# EAGLE design controller15 (EAGLE 9.4.2)

## Sheet 1 of 2
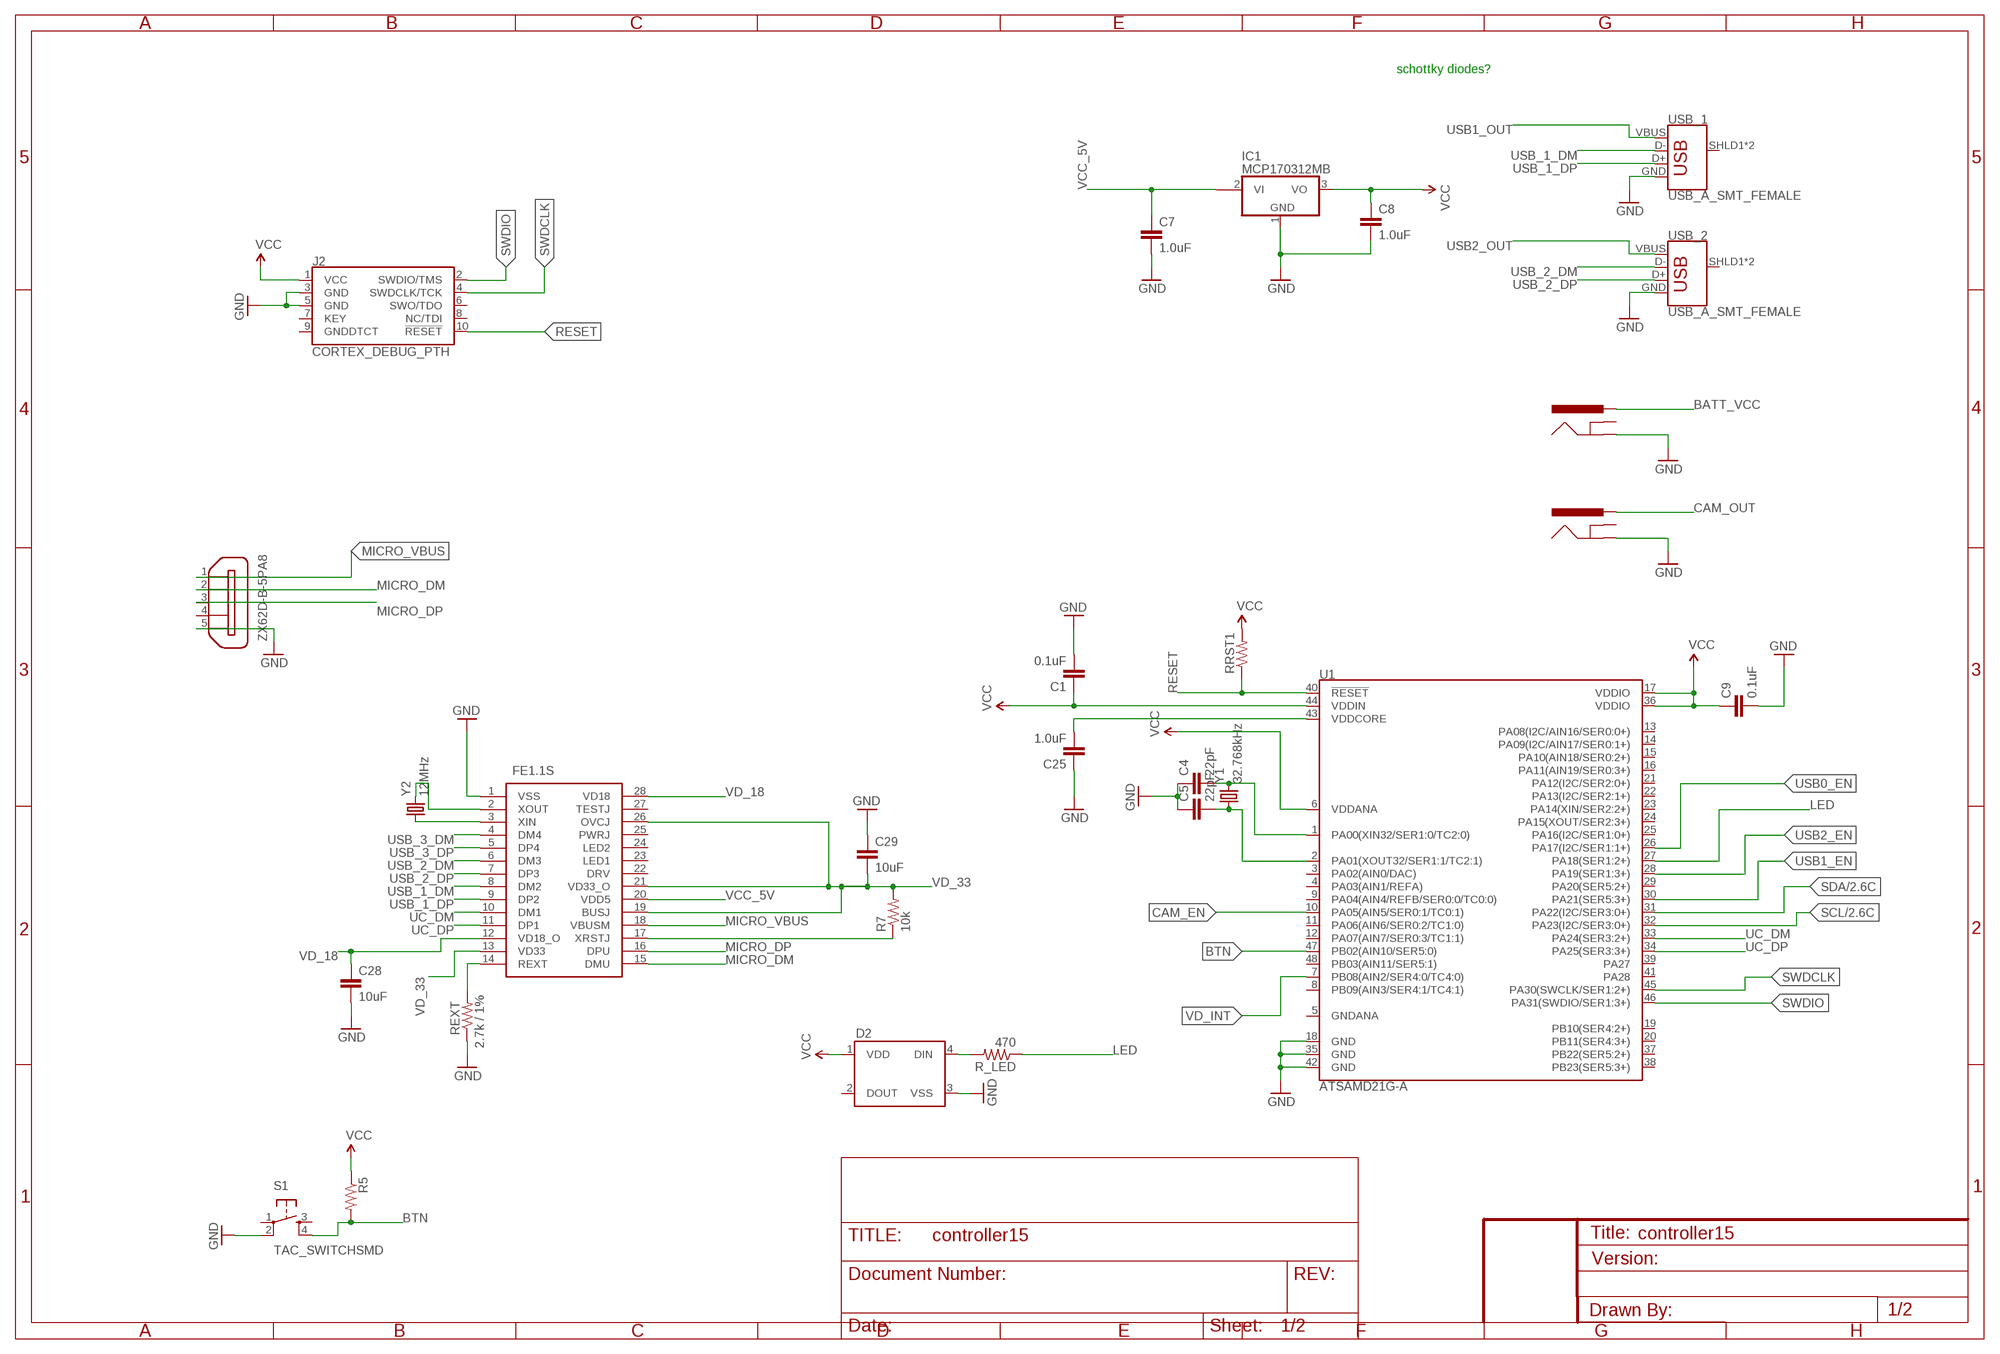
[diagram p0: schematic, sheet 1]

### Parts
C1  0.1uF  1.0UF-0805-25V-10%  [0805]
C4  22pF  CAP0805  [0805]
C5  22pF  CAP0805  [0805]
C7  1.0uF  1.0UF-1206-50V-10%  [1206]
C8  1.0uF  1.0UF-1206-50V-10%  [1206]
C9  0.1uF  1.0UF-0805-25V-10%  [0805]
C25  1.0uF  1.0UF-0805-25V-10%  [0805]
C28  10uF  1.0UF-0805-25V-10%  [0805]
C29  10uF  1.0UF-0805-25V-10%  [0805]
D2  WS2812B  [WS2812B]
IC1  MCP170312MB  [SOT89]
IC3  FE1.1S  [SOP64P600X175-28N]
J2  CORTEX_DEBUG_PTH  [2X5-PTH-1.27MM]
J3  POWER_JACKPTH_BREAD  [POWER_JACK_PTH_BREAD]
J4  POWER_JACKPTH_BREAD  [POWER_JACK_PTH_BREAD]
R5  RESISTOR0805-RES  [0805]
R7  10k  RESISTOR0805-RES  [0805]
R_LED  470  RESISTOR0805-RES  [0805]
REXT  2.7k / 1%  RESISTOR0805-RES  [0805]
RRST1  RESISTOR0805-RES  [0805]
S1  TAC_SWITCHSMD  [TACTILE-SWITCH-SMD]
U1  ATSAMD21G-A  [TQFP-48]
USB_1  USB_A_SMT_FEMALE  [USB-A-S-SILK-FEMALE]
USB_2  USB_A_SMT_FEMALE  [USB-A-S-SILK-FEMALE]
X2  ZX62D-B-5PA8  [ZX62D-B-5PA8]
Y1  32.768kHz  CRYSTAL3.2X1.5MM  [CRYSTAL-SMD-3.2X1.5MM]
Y2  12MHz  CRYSTAL3.2X1.5MM  [CRYSTAL-SMD-3.2X1.5MM]

### Nets
BATT_VCC [hub_power]: J4.PWR ; also sheet 2
BTN: R5.2 S1.4 U1.47(PB02(AIN10/SER5:0))
CAM_EN: U1.10(PA05(AIN5/SER0:1/TC0:1)) ; also sheet 2
CAM_OUT: J3.PWR ; also sheet 2
GND: C1.2 C4.1 C5.1 C7.2 C8.2 C9.2 C25.1 C28.2 C29.1 D2.3(VSS) IC1.1(GND) IC3.1(VSS) J2.3(GND) J2.5(GND) J3.GND J4.GND REXT.1 S1.2 U1.18(GND) U1.35(GND) U1.42(GND) USB_1.GND USB_2.GND X2.5 ; also sheet 2
LED: R_LED.1 U1.27(PA18(SER1:2+))
MICRO_DM: IC3.15(DMU) X2.2
MICRO_DP: IC3.16(DPU) X2.3
MICRO_VBUS: IC3.18(VBUSM) X2.1 ; also sheet 2
N$5: C25.2 U1.43(VDDCORE)
N$7: D2.4(DIN) R_LED.2
N$8: C4.2 U1.1(PA00(XIN32/SER1:0/TC2:0)) Y1.P$2
N$15: IC3.17(XRSTJ) R7.1
N$23: IC3.3(XIN) Y2.P$1
N$24: IC3.2(XOUT) Y2.P$2
N$31: IC3.14(REXT) REXT.2
N$32: C5.2 U1.2(PA01(XOUT32/SER1:1/TC2:1)) Y1.P$1
RESET: J2.10(!RESET) RRST1.1 U1.40(!RESET!)
SCL: U1.32(PA23(I2C/SER3:0+)) ; also sheet 2
SDA: U1.31(PA22(I2C/SER3:0+)) ; also sheet 2
SWDCLK: J2.4(SWDCLK/TCK) U1.45(PA30(SWCLK/SER1:2+))
SWDIO: J2.2(SWDIO/TMS) U1.46(PA31(SWDIO/SER1:3+))
UC_DM: IC3.10(DM1) U1.33(PA24(SER3:2+))
UC_DP: IC3.11(DP1) U1.34(PA25(SER3:3+))
USB0_EN: U1.26(PA17(I2C/SER1:1+)) ; also sheet 2
USB1_EN: U1.30(PA21(SER5:3+)) ; also sheet 2
USB1_OUT: USB_1.VBUS ; also sheet 2
USB2_EN: U1.28(PA19(SER1:3+)) ; also sheet 2
USB2_OUT: USB_2.VBUS ; also sheet 2
USB_1_DM: IC3.8(DM2) USB_1.D-
USB_1_DP: IC3.9(DP2) USB_1.D+
USB_2_DM: IC3.6(DM3) USB_2.D-
USB_2_DP: IC3.7(DP3) USB_2.D+
USB_3_DM: IC3.4(DM4)
USB_3_DP: IC3.5(DP4)
VCC [power]: C1.1 C8.1 C9.1 D2.1(VDD) IC1.3(VO) J2.1(VCC) R5.1 RRST1.2 U1.6(VDDANA) U1.17(VDDIO) U1.36(VDDIO) U1.44(VDDIN) ; also sheet 2
VCC_5V [power]: C7.1 IC1.2@1(VI1) IC3.20(VDD5) ; also sheet 2
VD_18: C28.1 IC3.12(VD18_O) IC3.28(VD18)
VD_33: C29.2 IC3.13(VD33) IC3.19(BUSJ) IC3.21(VD33_O) IC3.26(OVCJ) R7.2
VD_INT: U1.7(PB08(AIN2/SER4:0/TC4:0)) ; also sheet 2
Unconnected: D2.2(DOUT) IC1.2(VI) IC3.22(DRV) IC3.23(LED1) IC3.24(LED2) IC3.25(PWRJ) IC3.27(TESTJ) J2.6(SWO/TDO) J2.7(KEY) J2.8(NC/TDI) J2.9(GNDDTCT) J3.GNDBREAK J4.GNDBREAK S1.1 S1.3 U1.3(PA02(AIN0/DAC)) U1.4(PA03(AIN1/REFA)) U1.5(GNDANA) U1.8(PB09(AIN3/SER4:1/TC4:1)) U1.9(PA04(AIN4/REFB/SER0:0/TC0:0)) U1.11(PA06(AIN6/SER0:2/TC1:0)) U1.12(PA07(AIN7/SER0:3/TC1:1)) U1.13(PA08(I2C/AIN16/SER0:0+)) U1.14(PA09(I2C/AIN17/SER0:1+)) U1.15(PA10(AIN18/SER0:2+)) U1.16(PA11(AIN19/SER0:3+)) U1.19(PB10(SER4:2+)) U1.20(PB11(SER4:3+)) U1.21(PA12(I2C/SER2:0+)) U1.22(PA13(I2C/SER2:1+)) U1.23(PA14(XIN/SER2:2+)) U1.24(PA15(XOUT/SER2:3+)) U1.25(PA16(I2C/SER1:0+)) U1.29(PA20(SER5:2+)) U1.37(PB22(SER5:2+)) U1.38(PB23(SER5:3+)) U1.39(PA27) U1.41(PA28) U1.48(PB03(AIN11/SER5:1)) USB_1.SHLD1(SHIELD) USB_1.SHLD2(SHIELD) USB_2.SHLD1(SHIELD) USB_2.SHLD2(SHIELD) X2.4 X2.S1 X2.S2 X2.S3 X2.S4

### Notes on the sheet
- schottky diodes?

## Sheet 2 of 2
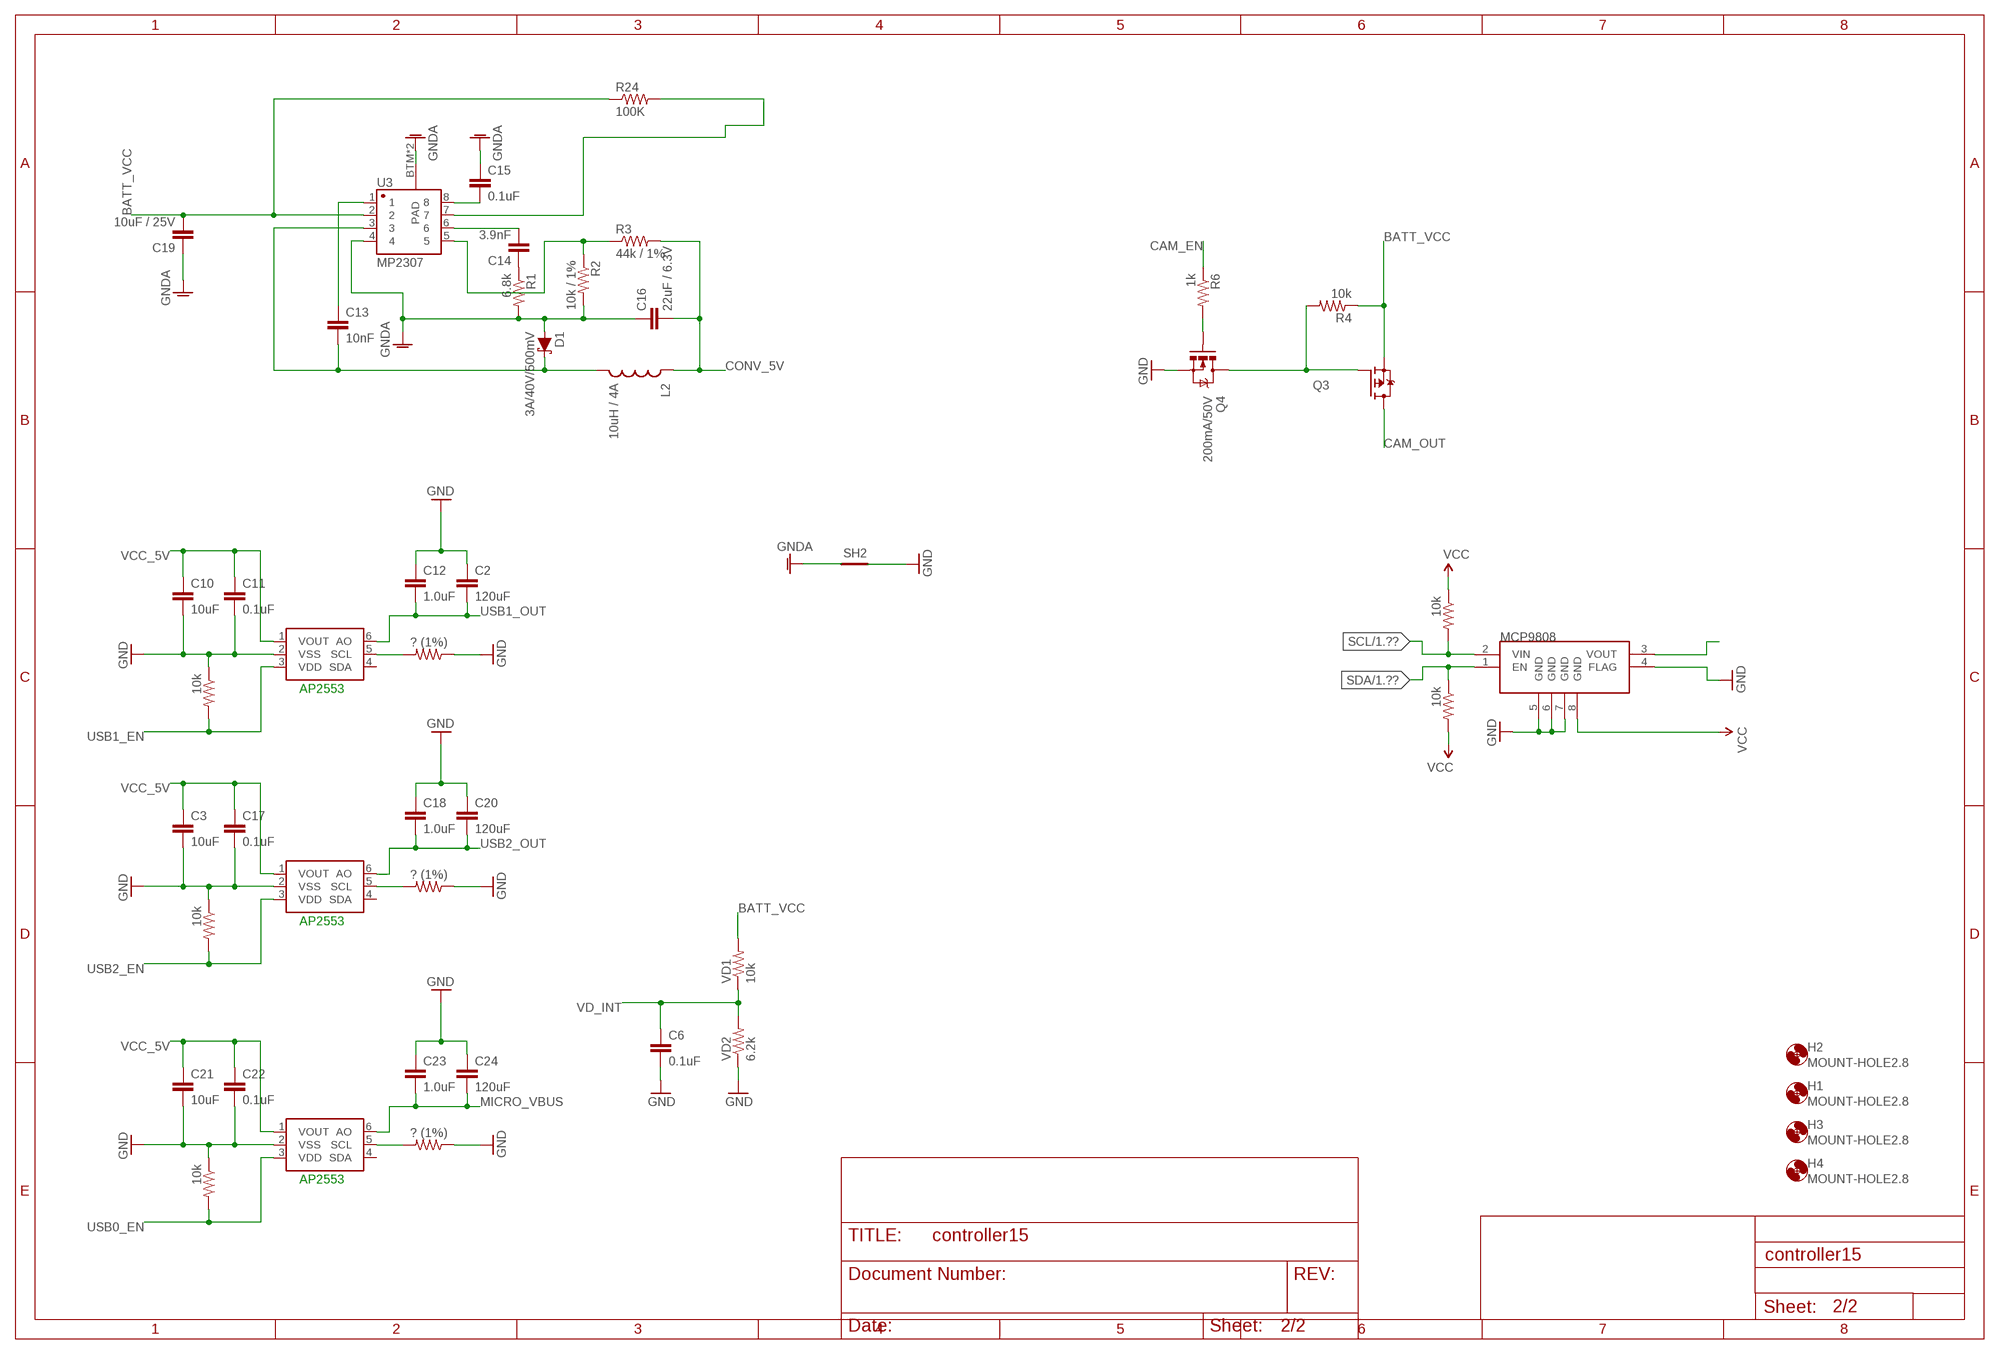
[diagram p1: schematic, sheet 2]

### Parts
AP1  MCP4725  MCP4725SOT-23  [SOT23-6]
AP2  MCP4725  MCP4725SOT-23  [SOT23-6]
AP2553  MCP4725  MCP4725SOT-23  [SOT23-6]
C2  120uF  1.0UF-1206-50V-10%  [1206]
C3  10uF  1.0UF-1206-50V-10%  [1206]
C6  0.1uF  CAP1206  [1206]
C10  10uF  1.0UF-1206-50V-10%  [1206]
C11  0.1uF  1.0UF-0805-25V-10%  [0805]
C12  1.0uF  1.0UF-1206-50V-10%  [1206]
C13  10nF  CAP0805  [0805]
C14  3.9nF  CAP1206  [1206]
C15  0.1uF  CAP1206  [1206]
C16  22uF / 6.3V  CAP1210  [1210]
C17  0.1uF  1.0UF-0805-25V-10%  [0805]
C18  1.0uF  1.0UF-1206-50V-10%  [1206]
C19  10uF / 25V  CAP1210  [1210]
C20  120uF  1.0UF-1206-50V-10%  [1206]
C21  10uF  1.0UF-1206-50V-10%  [1206]
C22  0.1uF  1.0UF-0805-25V-10%  [0805]
C23  1.0uF  1.0UF-1206-50V-10%  [1206]
C24  120uF  1.0UF-1206-50V-10%  [1206]
D1  3A/40V/500mV  DIODE-SCHOTTKY-B340A  [SMA-DIODE]
H1  MOUNT-HOLE2.8  [2,8]
H2  MOUNT-HOLE2.8  [2,8]
H3  MOUNT-HOLE2.8  [2,8]
H4  MOUNT-HOLE2.8  [2,8]
L2  10uH / 4A  INDUCTORSRU1038  [SRU1038]
MCP9808  V_REG_MIC5216  [MSOP8]
Q3  FDD4141TO252  [TO252]
Q4  200mA/50V  MOSFET-NCHANNELBSS138  [SOT23-3]
R1  6.8k  RESISTOR1206  [1206]
R2  10k / 1%  RESISTOR1206  [1206]
R3  44k / 1%  RESISTOR1206  [1206]
R4  10k  RESISTOR0805-RES  [0805]
R6  1k  RESISTOR0805-RES  [0805]
R24  100K  RESISTOR1206  [1206]
R_I2C_1  10k  RESISTOR0805-RES  [0805]
R_I2C_2  10k  RESISTOR0805-RES  [0805]
R_MOSFET_USB1  ? (1%)  RESISTOR0805-RES  [0805]
R_MOSFET_USB2  ? (1%)  RESISTOR0805-RES  [0805]
R_MOSFET_USB3  10k  RESISTOR0805-RES  [0805]
R_MOSFET_USB4  10k  RESISTOR0805-RES  [0805]
R_MOSFET_USB5  ? (1%)  RESISTOR0805-RES  [0805]
R_MOSFET_USB6  10k  RESISTOR0805-RES  [0805]
SH2  SHORT-HT5  [SHORT_TOP-50]
U3  MP2307  GENERIC-SOIC8MSGEQ7N-FILTER  [SO08]
VD1  10k  RESISTOR1206  [1206]
VD2  6.2k  RESISTOR1206  [1206]

### Nets
BATT_VCC [hub_power]: C19.2 Q3.2(S) R4.1 R24.1 U3.2 VD1.2 ; also sheet 1
CAM_EN: R6.1 ; also sheet 1
CAM_OUT: Q3.3(D) ; also sheet 1
CONV_5V [power]: C16.2 L2.1 R3.2
GND: AP1.2(VSS) AP2.2(VSS) AP2553.2(VSS) C2.1 C3.2 C6.2 C10.2 C11.2 C12.1 C17.2 C18.1 C20.1 C21.2 C22.2 C23.1 C24.1 MCP9808.4(FLAG) MCP9808.5(GND) MCP9808.6(GND) MCP9808.7(GND) Q4.2(S) R_MOSFET_USB1.1 R_MOSFET_USB2.1 R_MOSFET_USB3.1 R_MOSFET_USB4.1 R_MOSFET_USB5.1 R_MOSFET_USB6.1 SH2.2 VD2.1 ; also sheet 1
GNDA [power]: C15.1 C16.1 C19.1 D1.A R1.2 R2.2 SH2.1 U3.4 U3.BTM(PAD) U3.P$1(PAD)
MICRO_VBUS: AP2.6(AO) C23.2 C24.2 ; also sheet 1
N$2: Q4.1(G) R6.2
N$3: Q3.1(G) Q4.3(D) R4.2
N$4: MCP9808.3(VOUT)
N$9: AP2553.5(SCL) R_MOSFET_USB1.2
N$10: AP1.5(SCL) R_MOSFET_USB2.2
N$11: AP2.5(SCL) R_MOSFET_USB5.2
N$25: C15.2 U3.8
N$26 [power]: C13.2 D1.C L2.2 U3.3
N$27: C13.1 U3.1
N$28: C14.1 R1.1
N$29: C14.2 U3.6
N$30: R2.1 R3.1 U3.5
PB_BUCK_EN: R24.2 U3.7
SCL: MCP9808.2(VIN) R_I2C_1.2 ; also sheet 1
SDA: MCP9808.1(EN) R_I2C_2.1 ; also sheet 1
USB0_EN: AP2.3(VDD) R_MOSFET_USB6.2 ; also sheet 1
USB1_EN: AP2553.3(VDD) R_MOSFET_USB3.2 ; also sheet 1
USB1_OUT: AP2553.6(AO) C2.2 C12.2 ; also sheet 1
USB2_EN: AP1.3(VDD) R_MOSFET_USB4.2 ; also sheet 1
USB2_OUT: AP1.6(AO) C18.2 C20.2 ; also sheet 1
VCC [power]: MCP9808.8(GND) R_I2C_1.1 R_I2C_2.2 ; also sheet 1
VCC_5V [power]: AP1.1(VOUT) AP2.1(VOUT) AP2553.1(VOUT) C3.1 C10.1 C11.1 C17.1 C21.1 C22.1 ; also sheet 1
VD_INT: C6.1 VD1.1 VD2.2 ; also sheet 1
Unconnected: AP1.4(SDA) AP2.4(SDA) AP2553.4(SDA)

### Notes on the sheet
- AP2553
- AP2553
- AP2553

## Library data of the parts
AP1 AP2 AP2553 = SparkFun-IC-Conversion:MCP4725: MCP4725 DAC Microchip 12-bit I2C DAC, SOT23-6 Datasheet <https://cdn.sparkfun.com/datasheets/BreakoutBoards/MCP4725_2009.pdf> SparkFun Products SparkFun I2C DAC Breakout - MCP4725 <https://www.sparkfun.com/products/12918> (BOB-12918); PROD_ID: IC-08886
C1 C9 C11 C17 C22 C28 C29 = SparkFun-Capacitors:1.0UF: 1µF ceramic capacitors A capacitor is a passive two-terminal electrical component used to store electrical energy temporarily in an electric field.; PROD_ID: CAP-08064; VALUE: 1.0uF
C2 C3 C10 C20 C21 C24 = SparkFun-Capacitors:1.0UF: 1µF ceramic capacitors A capacitor is a passive two-terminal electrical component used to store electrical energy temporarily in an electric field.; PROD_ID: CAP-09822; VALUE: 1.0uF
C4 C5 = SparkFun-Passives:CAP: Capacitor Standard 0603 ceramic capacitor, and 0.1" leaded capacitor.
C6 C13-C16 C19 = SparkFun-Capacitors:CAP: Capacitor Standard 0603 ceramic capacitor, and 0.1" leaded capacitor.
C7 C8 C12 C18 C23 = SparkFun-Capacitors:1.0UF: 1µF ceramic capacitors A capacitor is a passive two-terminal electrical component used to store electrical energy temporarily in an electric field.; PROD_ID: CAP-09822
C25 = SparkFun-Capacitors:1.0UF: 1µF ceramic capacitors A capacitor is a passive two-terminal electrical component used to store electrical energy temporarily in an electric field.; PROD_ID: CAP-08064
D1 = SparkFun-DiscreteSemi:DIODE-SCHOTTKY: Schottky diode A Schottky diode is a semiconductor diode which has a low forward voltage drop and a very fast switching action.; PROD_ID: DIO-09886
D2 = SparkFun-LED:WS2812B: WS2812B - Intelligent control LED integrated light source Technical Specifications: Power Supply Voltage (VDD): 3.5 to 5.3 V Input Voltage (VI): -0.5 to VDD+0.5 V Operating Junction Temperature (Topt): -25°C to +80°C Storage Temperature Range (Tstg): -55°C to +150°C; PROD_ID: DIO-12503
H1-H4 = holes:MOUNT-HOLE: MOUNTING HOLE with drill center marker
IC1 = linear:MCP1703*: 250 mA, 16V, Low Quiescent Current LDO Regulator Source: http://ww1.microchip.com/downloads/en/DeviceDoc/22049b.pdf
IC3 = FE1.1S:FE1.1S: USB 2.0 HIGH SPEED 4-PORT HUB CONTROLLER Source: Datasheet <https://cdn-shop.adafruit.com/product-files/2991/FE1.1s Data Sheet (Rev. 1.0).pdf>; DESCRIPTION: USB 2.0 HIGH SPEED 4-PORT HUB CONTROLLER; HEIGHT: 1.75mm; MANUFACTURER_NAME: JFD IC; MANUFACTURER_PART_NUMBER: FE1.1S
J2 = SparkFun-Connectors:CORTEX_DEBUG: Cortex Debug Connector - 10 pin Supports JTAG debug, Serial Wire debug, and Serial Wire Viewer. PTH and SMD connector options available. General Connector Information <http://infocenter.arm.com/help/topic/com.arm.doc.faqs/attached/13634/cortex_debug_connectors.pdf> Products: PTH Connector <http://www.digikey.com/product-detail/en/cnc-tech/3220-10-0100-00/1175-1627-ND/3883661> -via Digi-Key SparkFun PSoc <https://www.sparkfun.com/products/13229> SparkFun T <https://www.sparkfun.com/products/13810>
J3 J4 = SparkFun-Connectors:POWER_JACK: Power Jack Connector This is the standard 5.5mm barrel jack for power. The PTH is the most common, proven, reliable, footprint. The Slot footprint only works if the mill layer is transmitted to the PCB fab house so be warned. Here are the connectors we sell at SparkFun: DC Barrel Power Jack/Connector <https://www.sparkfun.com/products/119> (PRT-00119) DC Barrel Power Jack/Connector (SMD) <https://www.sparkfun.com/products/12748> (PRT-12748) DC Barrel Jack Adapter - Breadboard Compatible <https://www.sparkfun.com/products/10811> (PRT-10811) It is used on this SparkFun product (and many, many others): SparkFun RedBoard - Programmed with Arduino <https://www.sparkfun.com/products/12757> (DEV-12757) Also, if you need a mating power supply or connector, please check these out: Wall Adapter Power Supply - 9VDC 650mA <https://www.sparkfun.com/products/298> (TOL-00298) DC Barrel Jack Adapter - Male <https://www.sparkfun.com/products/10287> (PRT-10287); PROD_ID: PRT-10811
L2 = SparkFun-Passives:INDUCTOR: Inductors Basic Inductor/Choke - 0603 and 1206. Footprints are not proven and vary greatly between part numbers. INDUCTOR POWER 3.3UH 4.0A SMD 0.197" L x 0.197" W x 0.177" H (5.00mm x 5.00mm x 4.50mm)
MCP9808 = SparkFun-IC-Power:V_REG_MIC5216: 500mA LDO, MSOP8 for better dissipation; PROD_ID: IC-09527
Q3 = transistor-fet:FDD4141: P-Channel PowerTrench® MOSFET Source: FDD4141.pdf
Q4 = SparkFun-DiscreteSemi:MOSFET-NCHANNEL: Common NMOSFET Parts MFG P/N Store ID Prod ID FDD8780 TRANS-09984 SI7820DN TRANS-11055 FDS6630A IC-08089 2N7002PW TRANS-11151 FQP30N06L COM-10213 TRANS-10060 BSS123LT1G TRANS-08345 BSS138 TRANS-00830 BS170 2N7000; PROD_ID: TRANS-00830
R1-R4 R6 R24 R_LED = SparkFun-Resistors:RESISTOR: Resistor Basic schematic elements and footprints for 0603, 1206, and PTH resistors.
R5 R7 R_I2C_1 R_I2C_2 R_MOSFET_USB1-R_MOSFET_USB6 REXT RRST1 VD1 VD2 = SparkFun-Passives:RESISTOR: Resistor Basic schematic elements and footprints for 0603, 1206, and PTH resistors.
S1 = SparkFun-Retired:TAC_SWITCH: Momentary Switch Button commonly used for reset or general input. Spark Fun Electronics SKU : COM-00097 SMT- SWCH-08247; PROD_ID: SWCH-08247
SH2 = shorts:SHORT-H: Short between two nets; BOM: no
U1 = SparkFun-IC-Microcontroller:ATSAMD21G: Atmel SAMD21G SMART ARM-Based Microcontroller The Atmel ® | SMART ™ SAM D21 is a series of low-power microcontrollers using the 32-bit ARM ® Cortex ® -M0+ processor, and ranging from 32- to 64-pins with up to 256KB Flash and 32KB of SRAM. The SAM D21 devices operate at a maximum frequency of 48MHz and reach 2.46 CoreMark/MHz. They are designed for simple and intuitive migration with identical peripheral modules, hex compatible code, identical linear address map and pin compatible migration paths between all devices in the product series. All devices include intelligent and flexible peripherals, Atmel Event System for inter-peripheral signaling, and support for capacitive touch button, slider and wheel user interfaces. Datasheet <https://cdn.sparkfun.com/datasheets/Dev/Arduino/Boards/Atmel-42181-SAM-D21_Datasheet.pdf> SparkFun Products SparkFun SAMD21 Mini Breakout <https://www.sparkfun.com/products/13664> (DEV-13664) SparkFun SAMD21 Dev Breakout <https://www.sparkfun.com/products/13672> (DEV-13672); PROD_ID: IC-13064
U3 = SparkFun-AnalogIC:GENERIC-SOIC8: A placeholder for generic narrow & wide SOIC8 foorptints - used on the DIP adapter board.; PROD_ID: IC-10141
USB_1 USB_2 = SparkFun-Connectors:USB_A: USB-A Connector Male and female variants, as well as PTH and SMT variants SparkFun Products: SparkFun XBee Explorer Dongle <https://www.sparkfun.com/products/11697> PTH Male SparkFun MicroView-USB Programmer <https://www.sparkfun.com/products/12924> SMT Male SparkFun USB Type A Female Breakout <https://www.sparkfun.com/products/12700> SMT Female; PROD_ID: CONN-09520; SF_ID: PRT-09011
X2 = zx62d-b-5pa8-oshpark_10:ZX62D-B-5PA8: Micro USB Type B Connector - Standard, Shell Through Hole Source: http://www.hirose.co.jp/cataloge_hp/ed_ZX_20140804.pdf; MF: Hirose; MPN: ZX62D-B-5PA8; OC_FARNELL: 2300438; OC_NEWARK: 69W0712
Y1 = SparkFun-FreqCtrl:CRYSTAL: Various standard crystals. Proven footprints.; PROD_ID: XTAL-13062
Y2 = SparkFun-FreqCtrl:CRYSTAL: Various standard crystals. Proven footprints.; PROD_ID: XTAL-13062; VALUE: 32.768kHz

## Net classes
0 default: width 0.254 mm, clearance 0.152 mm
1 power: width 0.254 mm, clearance 0.254 mm
2 hub_power: width 0.584 mm, clearance 0.254 mm
3 usbsignal: width 0.254 mm, clearance 0.203 mm
4 highpower: clearance 0.305 mm

## Board
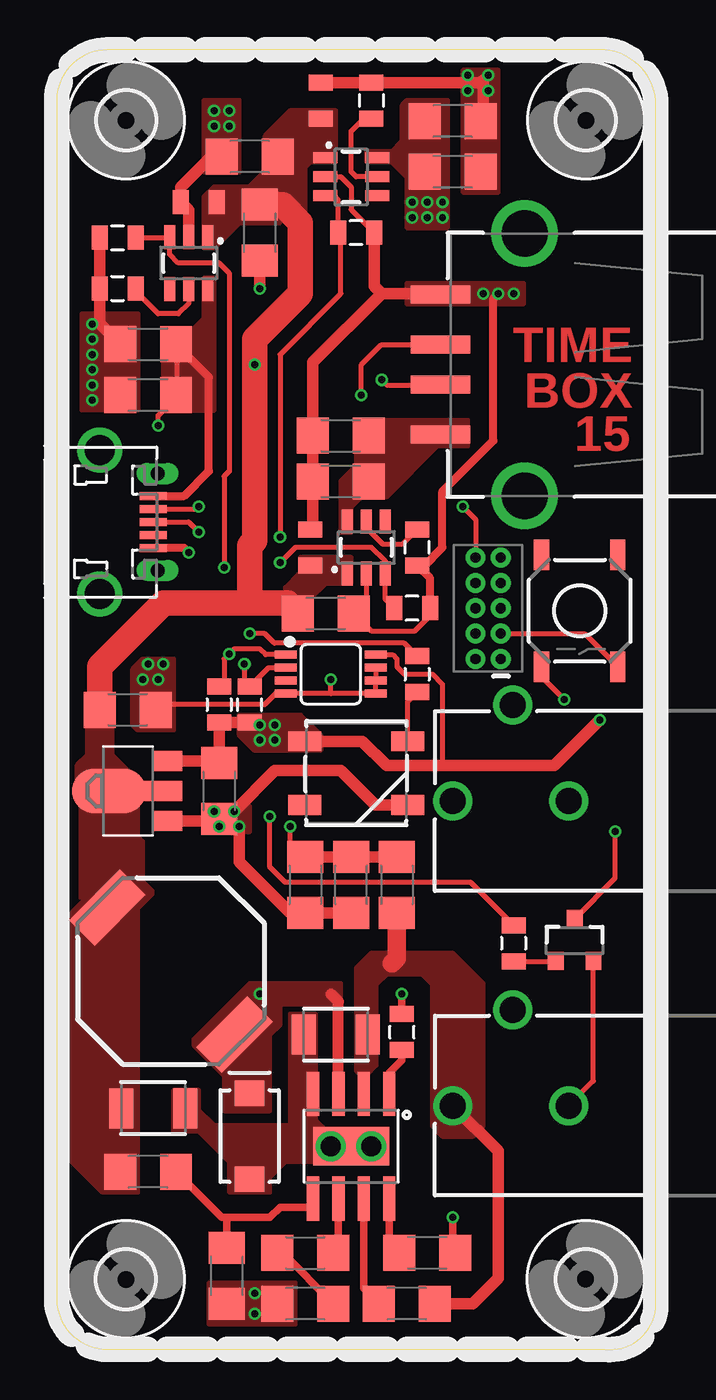
[diagram p2: board, top side]
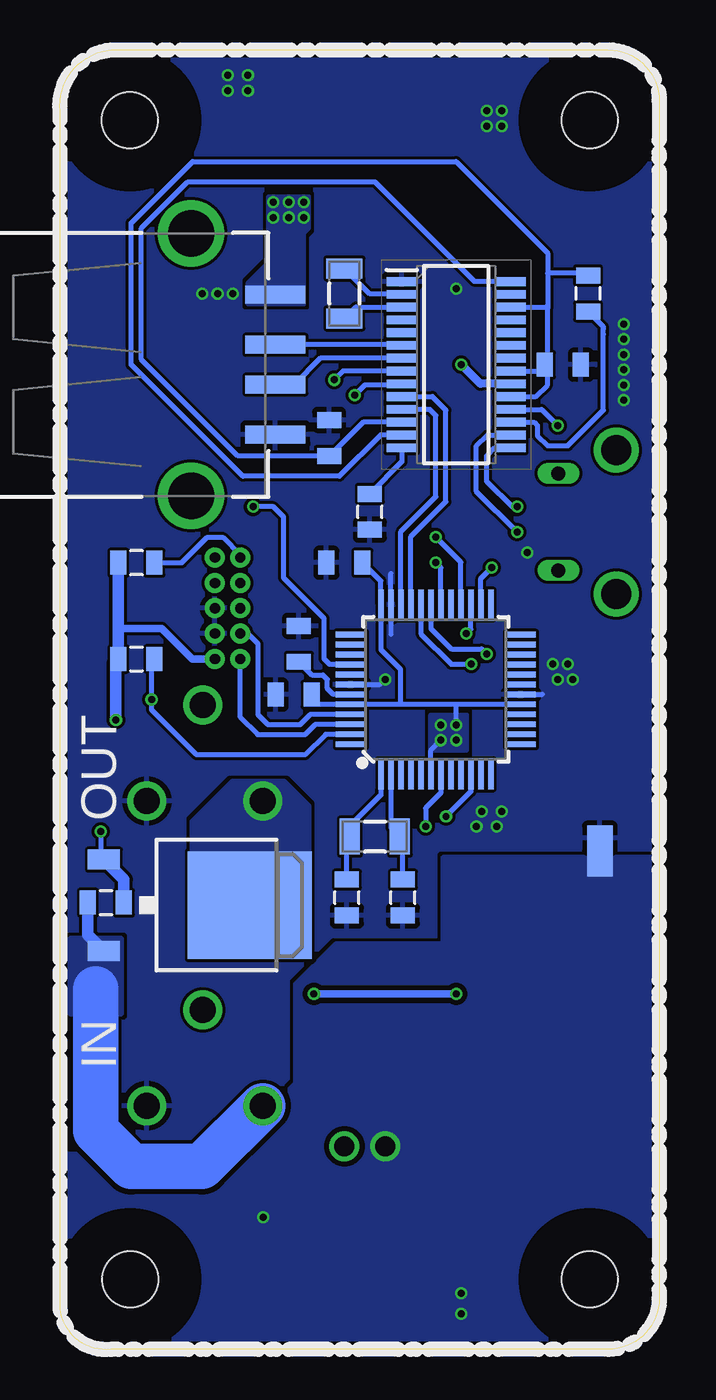
[diagram p3: board, bottom side, seen from below]

Size 29.98 x 65.04 mm. Coordinates in mm from the lower left corner, seen from the top.
Outline: 0,2.55 arc90 2.54,0.01 27.43,0.01 arc90 29.97,2.05 29.97,61.99 arc90 27.43,65.04 2.54,65.04 arc90 0,62.5 0,2.55
Copper layers (1*16): Top 0.035559375mm / dielectric 1.6mm / Bottom 0.035559375mm
Design rules "oshpark-2layer": minimum track width 6mil, minimum drill 10mil, track to track 6mil, track to pad 6mil, pad to pad 6mil, via to via 6mil, smd to smd 6mil, copper to edge 15mil, drill to drill 6mil, minimum pad ring 5mil, minimum via ring 5mil, stop-mask expansion 2.5mil, vias tented up to drill 0mil, thermal gap 10mil

### Footprints (pad centres in the part's own frame; a part is rotated, then mirrored left to right if it is on the bottom)
SOT23-6 = smd 0.55 x 1.2: 1 0.95,1.3; 2 0,1.3; 3 -0.95,1.3; 4 -0.95,-1.3; 5 0,-1.3; 6 0.95,-1.3
0805 = smd 0.8 x 1.2: 1 -0.9,0; 2 0.9,0
1206 = smd 1.6 x 1.8: 1 -1.4,0; 2 1.4,0
1210 = smd 1.2 x 2: 1 -1.6,0; 2 1.6,0
SMA-DIODE = smd 1.27 x 1.47: A -2.15,0; C 2.15,0
WS2812B = smd 1.651 x 1: 1 -2.577,1.6; 2 -2.577,-1.6; 3 2.577,-1.6; 4 2.577,1.6
2,8 = hole 2.8: 0,0
SOT89 = smd 1 x 1.5: 1 -1.499,-1.981; 3 1.499,-1.981 | smd 1 x 2: 2 0,-1.727 | smd 2.2 x 3.7: 2@1 0,0.94
SOP64P600X175-28N = smd 1.525 x 0.44: 1 -2.712,4.16; 2 -2.712,3.52; 3 -2.712,2.88; 4 -2.712,2.24; 5 -2.712,1.6; 6 -2.712,0.96; 7 -2.712,0.32; 8 -2.712,-0.32; 9 -2.712,-0.96; 10 -2.712,-1.6; 11 -2.712,-2.24; 12 -2.712,-2.88; 13 -2.712,-3.52; 14 -2.712,-4.16; 15 2.712,-4.16; 16 2.712,-3.52; 17 2.712,-2.88; 18 2.712,-2.24; 19 2.712,-1.6; 20 2.712,-0.96; 21 2.712,-0.32; 22 2.712,0.32; 23 2.712,0.96; 24 2.712,1.6; 25 2.712,2.24; 26 2.712,2.88; 27 2.712,3.52; 28 2.712,4.16
2X5-PTH-1.27MM = drill 0.508 pad 1: 1 -2.54,-0.635; 2 -2.54,0.635; 3 -1.27,-0.635; 4 -1.27,0.635; 5 0,-0.635; 6 0,0.635; 7 1.27,-0.635; 8 1.27,0.635; 9 2.54,-0.635; 10 2.54,0.635
POWER_JACK_PTH_BREAD = drill 1.3: GND 0,7.9; GNDBREAK 4.8,10.7; PWR 0,13.7
SRU1038 = smd 1.8 x 3.6: 1 -4.5,0; 2 4.5,0
MSOP8 = smd 0.4 x 1.1: 1 -0.975,-2.25; 2 -0.325,-2.25; 3 0.325,-2.25; 4 0.975,-2.25; 5 0.975,2.25; 6 0.325,2.25; 7 -0.325,2.25; 8 -0.975,2.25
TO252 = smd 1 x 1.6: 1 -2.28,-4.8; 2 2.28,-4.8 | smd 5.4 x 6.2: 3 0,2.5
SOT23-3 = smd 0.8 x 0.9: 1 -0.95,-1; 2 0.95,-1; 3 0,1.1
TACTILE-SWITCH-SMD = smd 1.524 x 0.762: 1 -2.794,1.905; 2 2.794,1.905; 3 -2.794,-1.905; 4 2.794,-1.905
SHORT_TOP-50 = smd 1.27 x 1.27: 1 0.635,0; 2 -0.635,0
TQFP-48 = smd 1.5 x 0.28: 1 -4.25,2.75; 2 -4.25,2.25; 3 -4.25,1.75; 4 -4.25,1.25; 5 -4.25,0.75; 6 -4.25,0.25; 7 -4.25,-0.25; 8 -4.25,-0.75; 9 -4.25,-1.25; 10 -4.25,-1.75; 11 -4.25,-2.25; 12 -4.25,-2.75; 25 4.25,-2.75; 26 4.25,-2.25; 27 4.25,-1.75; 28 4.25,-1.25; 29 4.25,-0.75; 30 4.25,-0.25; 31 4.25,0.25; 32 4.25,0.75; 33 4.25,1.25; 34 4.25,1.75; 35 4.25,2.25; 36 4.25,2.75 | smd 0.28 x 1.5: 13 -2.75,-4.25; 14 -2.25,-4.25; 15 -1.75,-4.25; 16 -1.25,-4.25; 17 -0.75,-4.25; 18 -0.25,-4.25; 19 0.25,-4.25; 20 0.75,-4.25; 21 1.25,-4.25; 22 1.75,-4.25; 23 2.25,-4.25; 24 2.75,-4.25; 37 2.75,4.25; 38 2.25,4.25; 39 1.75,4.25; 40 1.25,4.25; 41 0.75,4.25; 42 0.25,4.25; 43 -0.25,4.25; 44 -0.75,4.25; 45 -1.25,4.25; 46 -1.75,4.25; 47 -2.25,4.25; 48 -2.75,4.25
SO08 = smd 0.61 x 2.21: 1 -1.905,-2.616; 2 -0.635,-2.616; 3 0.635,-2.616; 4 1.905,-2.616; 5 1.905,2.616; 6 0.635,2.616; 7 -0.635,2.616; 8 -1.905,2.616 | smd 3.81 x 1.93: BTM 0,0 | drill 1: P$1 1.016,0; P$2 -1.016,0
USB-A-S-SILK-FEMALE = smd 3 x 0.9: D+ 7.212,-1; D- 7.212,1; GND 7.212,-3.5; VBUS 7.212,3.5 | drill 2.311: SHLD1 3,-6.566; SHLD2 3,6.566
ZX62D-B-5PA8 = smd 1.35 x 0.4: 1 4.825,1.3; 2 4.825,0.65; 3 4.825,0; 4 4.825,-0.65; 5 4.825,-1.3 | drill 1.5: S1 2.15,-3.6; S2 2.15,3.6 | drill 0.7 long: S3 5.05,2.425; S4 5.05,-2.425
CRYSTAL-SMD-3.2X1.5MM = smd 1 x 1.8: P$1 -1.25,0; P$2 1.25,0

### Placement (x,y rotation side)
AP1  14.73,58.69 90 top
AP2  6.6,54.37 0 top
AP2553  15.49,40.15 180 top
C1  18.29,32.78 180 bottom
C2  14.22,45.73 0 top
C3  9.65,59.7 180 top
C4  15.62,22.62 90 bottom
C5  12.83,22.62 90 bottom
C6  12.45,23.25 270 top
C7  3.56,32.02 0 top
C8  8.13,27.95 270 top
C9  15.75,39.38 180 bottom
C10  13.46,36.84 0 top
C11  12.7,40.15 90 top
C12  14.22,43.45 0 top
C13  17.27,15.89 90 top
C14  12.45,4.84 0 top
C15  18.54,4.84 180 top
C16  4.83,12.08 180 top
C17  13.21,62.5 90 top
C18  19.81,58.94 180 top
C19  13.97,15.76 0 top
C20  19.81,61.48 180 top
C21  10.16,55.89 270 top
C22  7.11,57.42 180 top
C23  4.57,47.77 0 top
C24  4.57,50.31 0 top
C25  18.03,35.32 270 bottom
C28  16.51,45.62 90 bottom
C29  4.83,49.29 180 bottom
D1  9.65,10.68 90 top
D2  14.99,28.84 0 top
H1  26.47,3.52 0 top
H2  26.48,61.52 0 top
H3  3.47,3.51 0 top
H4  3.47,61.51 0 top
IC1  3.56,27.95 90 top
IC3  10.16,49.29 0 bottom
J2  21.59,37.1 90 top
J3  33.53,27.45 90 top
J4  33.53,12.21 90 top
L2  5.71,18.94 315 top
MCP9808  13.72,33.8 270 top
Q3  22.99,22.24 270 bottom
Q4  25.91,20.46 0 top
R1  12.45,2.3 180 top
R2  8.51,3.7 270 top
R3  4.57,8.9 180 top
R4  27.69,22.37 0 bottom
R5  26.16,34.56 0 bottom
R6  22.86,20.33 270 top
R7  3.56,52.85 90 bottom
R24  17.53,2.3 180 top
R_I2C_1  9.65,32.27 90 top
R_I2C_2  8.13,32.27 270 top
R_LED  18.03,33.8 270 top
R_MOSFET_USB1  18.03,40.15 90 top
R_MOSFET_USB2  15.75,62.5 270 top
R_MOSFET_USB3  17.78,37.1 180 top
R_MOSFET_USB4  14.99,55.89 180 top
R_MOSFET_USB5  3.05,53.1 0 top
R_MOSFET_USB6  3.05,55.64 0 top
REXT  14.48,41.92 90 bottom
RRST1  26.16,39.38 180 bottom
S1  26.16,36.97 270 top
SH2  2.97,24.96 270 bottom
U1  11.18,33.03 90 bottom
U3  14.73,10.17 180 top
USB_1  26.42,49.29 180 top
USB_2  26.42,49.29 0 bottom
VD1  17.02,23.25 270 top
VD2  14.73,23.25 90 top
X2  0,41.42 0 top
Y1  14.22,25.67 180 bottom
Y2  15.75,52.85 90 bottom

### Tracks (layer width: path | path; a pad name or v marks a point on that pad's centre or on a via)
BATT_VCC
  Top 0.584: R24.1 20.83,2.3 22.1,3.57 22.1,9.94 J4.PWR
  Top 0.914: VD1.2 17.02,19.57 16.76,19.32
  Bottom 0.584: R4.1 28.59,20.76 Q3.2
  Bottom 2.286: J4.PWR 22.88,9.16 26.42,9.16 28.19,10.94 28.19,18.05
  pour Top (no thermals): 18.8,11.19 19.3,10.68 20.83,10.68 21.34,11.19 21.34,18.3 19.81,19.83 15.75,19.83 14.99,19.06 14.99,13.98 15.24,13.73 15.24,11.95 15.49,11.95 15.49,13.73 16,14.24 16,18.3 16.51,18.81 18.29,18.81 18.8,18.3
  pour Bottom (no thermals): 26.92,20.59 26.92,16.78 29.46,16.78 29.46,20.59
BTN  (via drill 0.35)
  Top 0.254: v25.4,32.53 24.26,33.67 S1.4
  Bottom 0.254: U1.47 16.7,30.78 17.71,29.77 23.15,29.77 25.4,32.02 v25.4,32.53 25.4,34.42 R5.2
CAM_EN  (via drill 0.35)
  Top 0.254: R6.1 20.71,23.38 11.43,23.38 10.67,24.14 v10.67,26.68
  Bottom 0.254: U1.10 9.43,27.93 v10.67,26.68
CAM_OUT
  pour Bottom (no thermals): 23.37,24.91 23.37,26.43 21.34,28.46 18.8,28.46 17.53,27.19 17.53,24.65 23.37,24.65
CONV_5V
  pour Top (no thermals): 3.3,24.4 0.76,21.86 0.76,9.41 2.29,7.89 4.06,7.89 4.06,22.11 4.83,22.87
GND  (via drill 0.35)
  Top 0.254: J4.GND 26.86,13.44 Q4.2 | AP1.2 14.22,58.69 14.73,58.18 14.73,57.05 R_MOSFET_USB4.1 | AP2553.2 15.49,37.48 C10.2 15.74,35.96 17.92,35.96 18.68,36.73 R_MOSFET_USB3.1 | MCP9808.7 MCP9808.6 MCP9808.5 13.72,32.82 | 13.72,32.82 MCP9808.4 10.96,32.82 10.41,32.27 5.21,32.27 C7.2 | J2.3 26.42,35.83 S1.2 | 18.09,39.19 R_MOSFET_USB1.1 | 13.72,32.82 v13.72,33.54
  Top 0.406: X2.5 6.38,40.12 v6.6,39.89 | R_MOSFET_USB3.1 18.68,38.6 18.09,39.19 | R_MOSFET_USB1.1 18.4,39.25 19.3,40.15 19.3,42.94 21.84,45.48 21.84,52.59 v22.1,52.85
  Top 0.584: VD2.1 C6.2 11.69,21.85 9.14,24.4 v9.14,26.18 | IC1.1 8.03,26.45 C8.2 | C24.1 2.15,51.33 R_MOSFET_USB5.1 R_MOSFET_USB6.1 | AP2.2 6.6,57.03 C22.2 6.21,58.17 7.74,59.7 C3.2 | C17.2 R_MOSFET_USB2.1 21.22,63.4 21.34,63.51 21.34,61.61 C20.1 | C21.2 v10.16,53.1 | 16.26,52.85 19.15,52.85 USB_1.GND | R_MOSFET_USB4.1 15.89,53.22 16.26,52.85 | 16.26,52.85 12.82,49.41 C2.1 C12.1 12.82,41.17 C11.2 | D2.3 15.95,27.24 14.22,28.97 10.92,28.97 v8.89,26.94
  Bottom 0.254: U1.18 5.85,32.78 | 13.43,38.84 U1.35 13.43,35.79 | U1.42 13.97,33.28 v13.72,33.54
  other vias: 21.34,52.85 22.86,52.85 20.57,63.01 21.59,63.01 21.59,63.77 20.57,63.77 1.78,47.51 1.78,48.27 1.78,49.04 1.78,49.8 1.78,50.56 1.78,51.32 7.87,61.99 8.64,61.99 8.64,61.23 7.87,61.23 4.32,33.54 5.08,33.54 4.57,34.3 5.33,34.3 7.87,26.94 8.13,26.18
  pour Bottom (rank 6): 29.84,0.01 0,0.01 0,65.04 17.56,65.18 29.84,65.04
  pour Top (no thermals): 17.53,53.35 17.53,52.34 23.37,52.34 23.37,53.35
  pour Top (no thermals): 20.32,57.93 22.1,57.93 22.1,64.02 20.32,64.02
  pour Top (no thermals): 4.06,47 1.27,47 1.27,51.83 4.06,51.83
  pour Top (no thermals): 7.37,58.94 9.14,58.94 9.14,62.5 7.37,62.5
  pour Top (no thermals): 5.84,31 4.06,31 3.81,31.26 3.81,33.8 3.81,34.05 4.32,34.56 5.84,34.56
  pour Top (no thermals): 7.37,27.19 7.37,25.92 9.65,25.92 9.65,27.19
GNDA  (via drill 0.35)
  Top 0.381: C15.1 19.81,4.97 v19.81,6.62
  other vias: 9.91,2.81 9.91,1.79
  pour Bottom (no thermals): 0,24.65 0,-0.11 12.57,-0.11 29.9,-0.54 29.9,9.79 21.72,9.79 18.19,13.32 18.19,13.37 18.19,18.28 16.13,20.33 10.79,20.33 10.79,24.65
  pour Top (no thermals): 11.94,3.32 7.62,3.32 7.62,1.28 11.94,1.28
  pour Top (no thermals): 12.95,16.78 11.68,16.78 11.68,11.19 7.87,11.19 7.11,11.95 7.11,12.97 5.84,12.97 5.84,10.94 7.11,10.94 8.64,9.41 8.64,7.89 10.67,7.89 10.67,8.65 11.43,9.41 16.51,9.41 16.51,10.94 13.46,10.94 12.95,11.44 12.95,11.95
LED  (via drill 0.35)
  Top 0.254: R_LED.1 17.38,35.35 10.89,35.35 10.41,35.83 v9.65,35.83
  Bottom 0.254: v9.65,35.83 9.43,36.05 U1.27
MICRO_DM  (via drill 0.35)
  Top 0.254: X2.2 7,42.07 v7.11,42.18
  Bottom 0.254: v7.11,42.18 7.37,42.18 8.64,43.45 8.64,44.72 8.22,45.13 IC3.15
MICRO_DP  (via drill 0.35)
  Top 0.254: X2.3 6.6,41.42 v7.11,40.91
  Bottom 0.254: v7.11,40.91 9.14,42.94 9.14,45.23 8.6,45.77 IC3.16
MICRO_VBUS  (via drill 0.35)
  Top 0.254: v5.08,46.24 5.08,46.75 5.97,47.64 C23.2 6.03,47.83 6.03,50.24
  Top 0.406: X2.1 6.38,42.72 7.62,43.96 7.62,48.66 6.03,50.24 C24.2
  Bottom 0.254: IC3.18 5.89,47.05 v5.08,46.24
  pour Top (no thermals): 7.37,53.61 7.37,52.34 7.37,51.58 6.86,51.07 5.33,51.07 5.33,47 7.87,47 7.87,53.61
N$2
  Top 0.254: R6.2 24.93,19.43 Q4.1
N$3  (via drill 0.35)
  Top 0.254: Q4.3 27.94,23.59 v27.94,25.92
  Bottom 0.254: v27.94,25.92 27.94,24.67 Q3.1
  Bottom 0.584: R4.2 26.79,23.52 Q3.1
N$5
  Bottom 0.254: C25.2 17.38,33.76 16.83,33.76 16.61,33.54 16.61,33.08 16.31,32.78 U1.43
N$7
  Top 0.254: D2.4 17.56,32.42 R_LED.2
N$8
  Bottom 0.254: U1.1 13.93,27.74 15.47,26.2 Y1.P$2 15.62,25.52 C4.2
N$9
  Top 0.254: AP2553.5 15.49,41.13 16.31,40.31 17.3,40.31 R_MOSFET_USB1.2
N$10
  Top 0.254: AP1.5 14.99,58.69 14.73,58.94 14.73,60.97 15.36,61.6 R_MOSFET_USB2.2
N$11
  Top 0.254: AP2.5 6.6,52.34 6.1,51.83 5.08,51.83 3.95,52.96 R_MOSFET_USB5.2
N$15
  Bottom 0.254: IC3.17 6.26,46.41 6.1,46.24 6.1,45.73 5.59,45.23 4.57,45.23 2.79,47 2.79,50.81 2.79,51.07 2.79,51.18 R7.1
N$23
  Bottom 0.254: Y2.P$1 15.17,52.17 IC3.3
N$24
  Bottom 0.254: Y2.P$2 14.5,52.85 12.91,52.85 IC3.2
N$25
  Top 0.381: C15.2 16.64,5.34 U3.8
N$26  (via drill 0.35)
  Top 0.381: C13.2 v17.27,17.79
  Top 0.559: U3.3 14.1,17.41 13.72,17.79
  Bottom 0.381: v17.27,17.79 v10.16,17.79
  pour Top (no thermals): 6.86,15.25 8.38,13.73 8.38,11.95 10.67,11.95 10.67,15.76 11.18,16.27 11.18,17.29 14.22,17.29 14.22,18.3 9.65,18.3 6.86,15.51
N$27
  Top 0.381: U3.1 16.64,13.85 17.27,14.48 C13.1
N$28
  Top 0.381: R1.1 11.31,4.84 C14.1
N$29
  Top 0.381: U3.6 14.1,5.09 C14.2
N$30
  Top 0.381: U3.5 12.7,7.43 12.7,7.13 11.18,7.13 10.67,6.62 8.64,6.62 | R3.1 8.26,6.62 8.64,6.62 | R2.1 8.51,6.49 8.64,6.62
N$31
  Bottom 0.254: IC3.14 12.87,44.43 REXT.2
N$32
  Bottom 0.254: U1.2 13.43,26.12 Y1.P$1 12.83,25.52 C5.2
PB_BUCK_EN
  Top 0.381: R24.2 15.37,3.06 U3.7
RESET  (via drill 0.35)
  Top 0.254: v20.32,42.18 20.95,41.54 J2.10
  Bottom 0.254: RRST1.1 23.88,39.38 22.61,40.65 21.84,40.65 20.95,39.76 J2.10 | U1.40 16.49,34.28 16.76,34.56 16.76,36.59 18.8,38.62 18.8,41.67 19.3,42.18 v20.32,42.18
SCL  (via drill 0.35)
  Top 0.254: v9.4,34.3 9.4,33.43 R_I2C_1.2 10.6,34.12 MCP9808.2
  Bottom 0.254: U1.32 11.93,35.82 10.41,34.3 v9.4,34.3
SDA  (via drill 0.35)
  Top 0.254: R_I2C_2.1 8.38,33.43 8.38,34.56 v8.64,34.81 8.89,35.07 10.15,35.07 10.45,34.77 MCP9808.1
  Bottom 0.254: U1.31 11.43,36.08 10.41,35.07 8.89,35.07 v8.64,34.81
SWDCLK
  Bottom 0.254: U1.45 17.46,31.78 17.97,31.28 19.58,31.28 20.07,31.76 20.07,35.32 20.57,35.83 J2.4
SWDIO
  Bottom 0.254: U1.46 17.2,31.28 17.71,30.78 20.09,30.78 20.95,31.64 J2.2
UC_DM
  Bottom 0.254: IC3.10 11.35,47.69 10.67,47 10.67,42.43 12.43,40.67 U1.33
UC_DP
  Bottom 0.254: U1.34 12.93,40.94 11.18,42.69 11.18,46.75 11.48,47.05 IC3.11
USB0_EN  (via drill 0.35)
  Top 0.254: v8.38,39.13 8.38,43.7 8.64,43.96 8.64,53.86 8.13,54.37 6.1,54.37 5.65,54.81 AP2.3 5.62,55.64 R_MOSFET_USB6.2
  Bottom 0.254: v8.38,39.13 8.93,38.59 U1.26
USB1_EN  (via drill 0.35)
  Top 0.254: R_MOSFET_USB3.2 16.44,37.53 AP2553.3 16.44,39.45 15.75,40.15 11.94,40.15 v11.18,39.38
  Bottom 0.254: U1.30 10.93,39.13 v11.18,39.38
USB1_OUT
  pour Top (no thermals): 14.22,40.91 14.73,40.91 14.73,41.92 14.73,42.18 15.24,42.69 16.51,42.69 19.05,45.23 20.57,45.23 20.57,46.5 14.99,46.5 14.99,44.21 14.22,43.45
USB2_EN  (via drill 0.35)
  Top 0.254: v11.18,40.65 11.18,49.8 14.22,52.85 14.22,55.76 R_MOSFET_USB4.2 14.09,57.56 13.9,57.74 AP1.3
  Bottom 0.254: v11.18,40.65 9.93,39.4 U1.28
USB2_OUT  (via drill 0.35)
  other vias: 17.78,57.42 17.78,56.66 18.54,57.42 18.54,56.66 19.3,57.42 19.3,56.66
  pour Top (no thermals): 19.56,62.5 17.53,62.5 17.27,62.24 17.27,60.47 16.76,59.96 15.49,59.96 15.49,59.45 16.76,59.45 17.53,58.69 17.53,56.15 19.56,56.15
  pour Bottom (no thermals): 20.57,52.34 17.78,52.34 17.78,55.89 17.53,56.15 17.53,57.67 19.56,57.67 19.56,54.37 20.57,53.35
USB_1_DM  (via drill 0.35)
  Top 0.254: v16.26,48.53 16.51,48.27 19.19,48.27 USB_1.D-
  Bottom 0.254: IC3.8 15.81,48.97 v16.26,48.53
USB_1_DP  (via drill 0.35)
  Top 0.254: v15.24,47.77 15.24,49.29 16.24,50.29 USB_1.D+
  Bottom 0.254: IC3.9 12.93,48.27 14.73,48.27 v15.24,47.77
USB_2_DM
  Bottom 0.254: IC3.6 12.91,50.29 USB_2.D-
USB_2_DP
  Bottom 0.254: IC3.7 16.95,49.61 18.27,48.29 USB_2.D+
VCC  (via drill 0.35)
  Top 0.254: MCP9808.8 16.8,34.77 17.02,34.56 17.02,34.17 17.39,33.8 18.8,33.8 19.3,33.29 19.3,29.22
  Top 0.584: IC1.3 8.03,29.45 C8.1 R_I2C_2.2 R_I2C_1.1 | D2.1 15.29,30.44 16.51,29.22 19.3,29.22 24.89,29.22 v27.18,31.51
  Bottom 0.254: 17.47,32.68 17.07,32.28 U1.44 12.95,32.28 | 12.95,32.28 12.95,34.05 13.93,35.02 U1.36 13.93,38.46 C9.1 | U1.17 10.16,32.28 | U1.6 11.43,29.99 v10.92,30.49 | v10.16,31.26 10.16,32.28 | 10.16,32.28 12.95,32.28
  Bottom 0.305: 17.47,32.68 C1.1
  Bottom 0.381: J2.1 23.37,34.56 24.89,36.08 27.06,36.08
  Bottom 0.584: v27.18,31.51 27.18,34.44 R5.1 27.06,36.08 RRST1.2
  other vias: 10.16,30.49 10.92,31.26
  pour Top (no thermals): 13.21,29.99 9.91,29.99 9.14,30.75 9.14,31.76 12.19,31.76 13.21,30.75
  pour Bottom: 9.65,31.76 9.65,29.99 11.43,29.99 11.43,31.76
VCC_5V  (via drill 0.35)
  Top 1.27: C7.1 2.16,34.17 5.33,37.35 9.65,37.35 | C10.1 11.55,37.35 9.65,37.35 | 9.65,37.35 9.65,40.24 9.91,40.49 v9.91,49.29 9.91,50.56 12.19,52.85 12.19,56.4 11.3,57.29 C21.1
  Bottom 0.406: IC3.20 8.95,48.33 v9.91,49.29
  pour Top (no thermals): 4.32,22.62 4.32,25.41 4.06,25.67 4.06,28.46 2.79,29.73 2.79,32.78 1.52,32.78 1.52,29.73 1.02,29.22 1.02,28.46 1.21,28.27 1.21,22.62
  pour Top (no thermals): 9.4,56.66 12.45,56.66 12.45,59.2 12.7,59.45 13.97,59.45 13.97,61.99 11.68,61.99 10.41,60.72 10.41,58.94 9.4,57.93
  pour Top (no thermals): 7.37,55.13 7.87,55.13 9.14,56.4 11.18,56.4 11.18,58.18 7.87,58.18 7.37,57.67
  pour Top (no thermals): 11.43,36.08 12.7,36.08 12.7,37.61 13.46,38.37 14.73,38.37 14.73,39.64 12.19,39.64 12.19,38.88 11.43,38.11
VD_18
  Bottom 0.254: IC3.12 14.82,46.41 C28.1 21.08,44.72 25.91,49.54 25.91,56.11 23.59,58.43 14.22,58.43 9.24,53.45 IC3.28
VD_33
  Bottom 0.254: IC3.19 6.17,47.69 5.59,48.27 5.59,48.78 | IC3.13 13.93,45.77 16,43.7 20.83,43.7 26.42,49.29 26.42,56.37 23.34,59.45 10.16,59.45 5.59,54.88 5.59,53.86 | 5.59,53.86 5.59,52.08 | IC3.26 5.67,52.17 5.59,52.08 | R7.2 3.67,53.86 5.59,53.86 | 5.59,48.78 5.59,52.08 | IC3.21 6.05,48.97 | 6.05,48.97 C29.2 | 6.05,48.97 5.78,48.97 5.59,48.78
VD_INT  (via drill 0.35)
  Top 0.254: C6.1 11.68,25.42 v11.68,26.18
  Top 0.584: VD1.1 VD2.2 C6.1
  Bottom 0.254: v11.68,26.18 11.68,27.1 10.93,27.85 U1.7

### Text on the board
Top: TIME | BOX | 15
bPlace: OUT | IN